# EAGLE schematic 1EE2CE-Multicell Battery Load Analyzer (EAGLE 9.7.0)

## Sheet 1 of 6
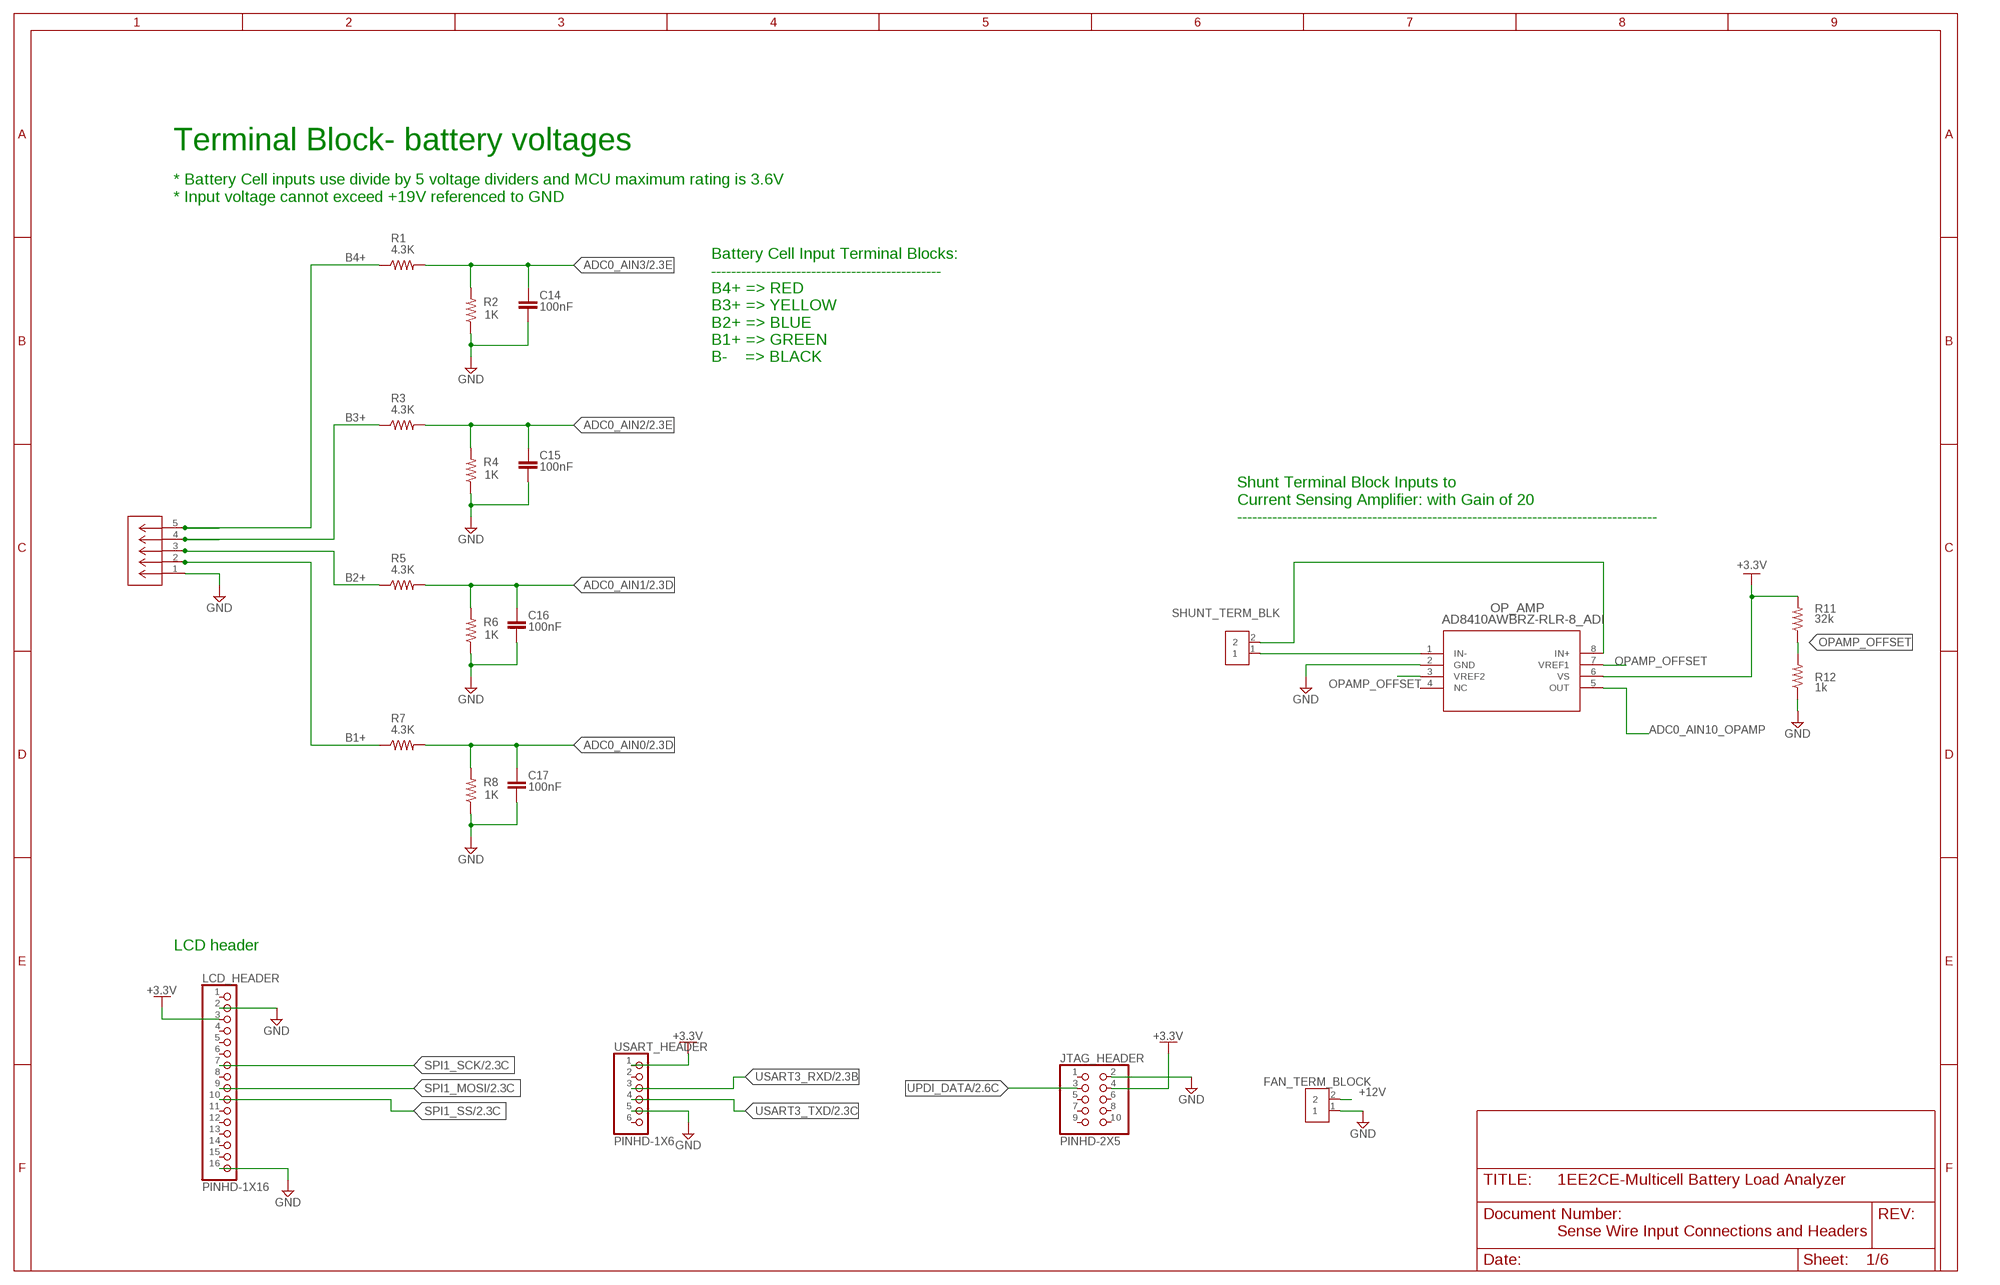
[diagram p0: schematic, sheet 1]

### Parts
BATTERY_TERM_BLK  OSTVN05A150CONN5_516X256_OST  [CONN5_516X256_OST]
C14  100nF  C_CHIP-0805(2012-METRIC)  [CAPC2012X110]
C15  100nF  C_CHIP-0805(2012-METRIC)  [CAPC2012X110]
C16  100nF  C_CHIP-0805(2012-METRIC)  [CAPC2012X110]
C17  100nF  C_CHIP-0805(2012-METRIC)  [CAPC2012X110]
FAN_TERM_BLOCK  TERM-BLK-2P  2828XX-2282837-2  [TERMBLK_508-2N]
JTAG_HEADER  PINHD-2X5  [2X05]
LCD_HEADER  PINHD-1X16  [1X16]
OP_AMP  AD8410AWBRZ-RLR-8_ADI  [R-8_ADI]
R1  4.3K  R-US_R0805  [R0805]
R2  1K  R-US_R0805  [R0805]
R3  4.3K  R-US_R0805  [R0805]
R4  1K  R-US_R0805  [R0805]
R5  4.3K  R-US_R0805  [R0805]
R6  1K  R-US_R0805  [R0805]
R7  4.3K  R-US_R0805  [R0805]
R8  1K  R-US_R0805  [R0805]
R11  32k  R-US_R0805  [R0805]
R12  1k  R-US_R0805  [R0805]
SHUNT_TERM_BLK  TERM-BLK-2P  2828XX-2282837-2  [TERMBLK_508-2N]
USART_HEADER  PINHD-1X6  [1X06]

### Nets
+3.3V: JTAG_HEADER.4 LCD_HEADER.3 OP_AMP.6(VS) R11.2 USART_HEADER.1 ; also sheet 2,3,4,6
+12V: FAN_TERM_BLOCK.2 ; also sheet 3,4,6
ADC0_AIN0: C17.1 R7.2 R8.2 ; also sheet 2,6
ADC0_AIN1: C16.1 R5.2 R6.2 ; also sheet 2,6
ADC0_AIN2: C15.1 R3.2 R4.2 ; also sheet 2,6
ADC0_AIN3: C14.1 R1.2 R2.2 ; also sheet 2,6
ADC0_AIN10_OPAMP: OP_AMP.5(OUT) ; also sheet 2,6
B1+: BATTERY_TERM_BLK.2 R7.1
B2+: BATTERY_TERM_BLK.3 R5.1
B3+: BATTERY_TERM_BLK.4 R3.1
B4+: BATTERY_TERM_BLK.5 R1.1
GND: BATTERY_TERM_BLK.1 C14.2 C15.2 C16.2 C17.2 FAN_TERM_BLOCK.1 JTAG_HEADER.2 LCD_HEADER.2 LCD_HEADER.16 OP_AMP.2(GND) R2.1 R4.1 R6.1 R8.1 R12.1 USART_HEADER.5 ; also sheet 2,3,4,5,6
N$8: OP_AMP.1(IN-) SHUNT_TERM_BLK.1
N$11: OP_AMP.8(IN+) SHUNT_TERM_BLK.2
OPAMP_OFFSET: OP_AMP.3(VREF2) OP_AMP.7(VREF1) R11.1 R12.2
SPI1_MOSI: LCD_HEADER.9 ; also sheet 2,6
SPI1_SCK: LCD_HEADER.7 ; also sheet 2,6
SPI1_SS: LCD_HEADER.10 ; also sheet 2,6
UPDI_DATA: JTAG_HEADER.3 ; also sheet 2
USART3_RXD: USART_HEADER.3 ; also sheet 2,6
USART3_TXD: USART_HEADER.4 ; also sheet 2,6
Unconnected: JTAG_HEADER.1 JTAG_HEADER.5 JTAG_HEADER.6 JTAG_HEADER.7 JTAG_HEADER.8 JTAG_HEADER.9 JTAG_HEADER.10 LCD_HEADER.1 LCD_HEADER.4 LCD_HEADER.5 LCD_HEADER.6 LCD_HEADER.8 LCD_HEADER.11 LCD_HEADER.12 LCD_HEADER.13 LCD_HEADER.14 LCD_HEADER.15 OP_AMP.4(NC) USART_HEADER.2 USART_HEADER.6

### Notes on the sheet
- Terminal Block- battery voltages
- * Battery Cell inputs use divide by 5 voltage dividers and MCU maximum rating is 3.6V
  * Input voltage cannot exceed +19V referenced to GND
- Battery Cell Input Terminal Blocks:
  ----------------------------------------------
  B4+ => RED
  B3+ => YELLOW
  B2+ => BLUE
  B1+ => GREEN
  B-    => BLACK
- Shunt Terminal Block Inputs to 
  Current Sensing Amplifier: with Gain of 20
  ------------------------------------------------------------------------------------
- LCD header
- Sense Wire Input Connections and Headers

## Sheet 2 of 6
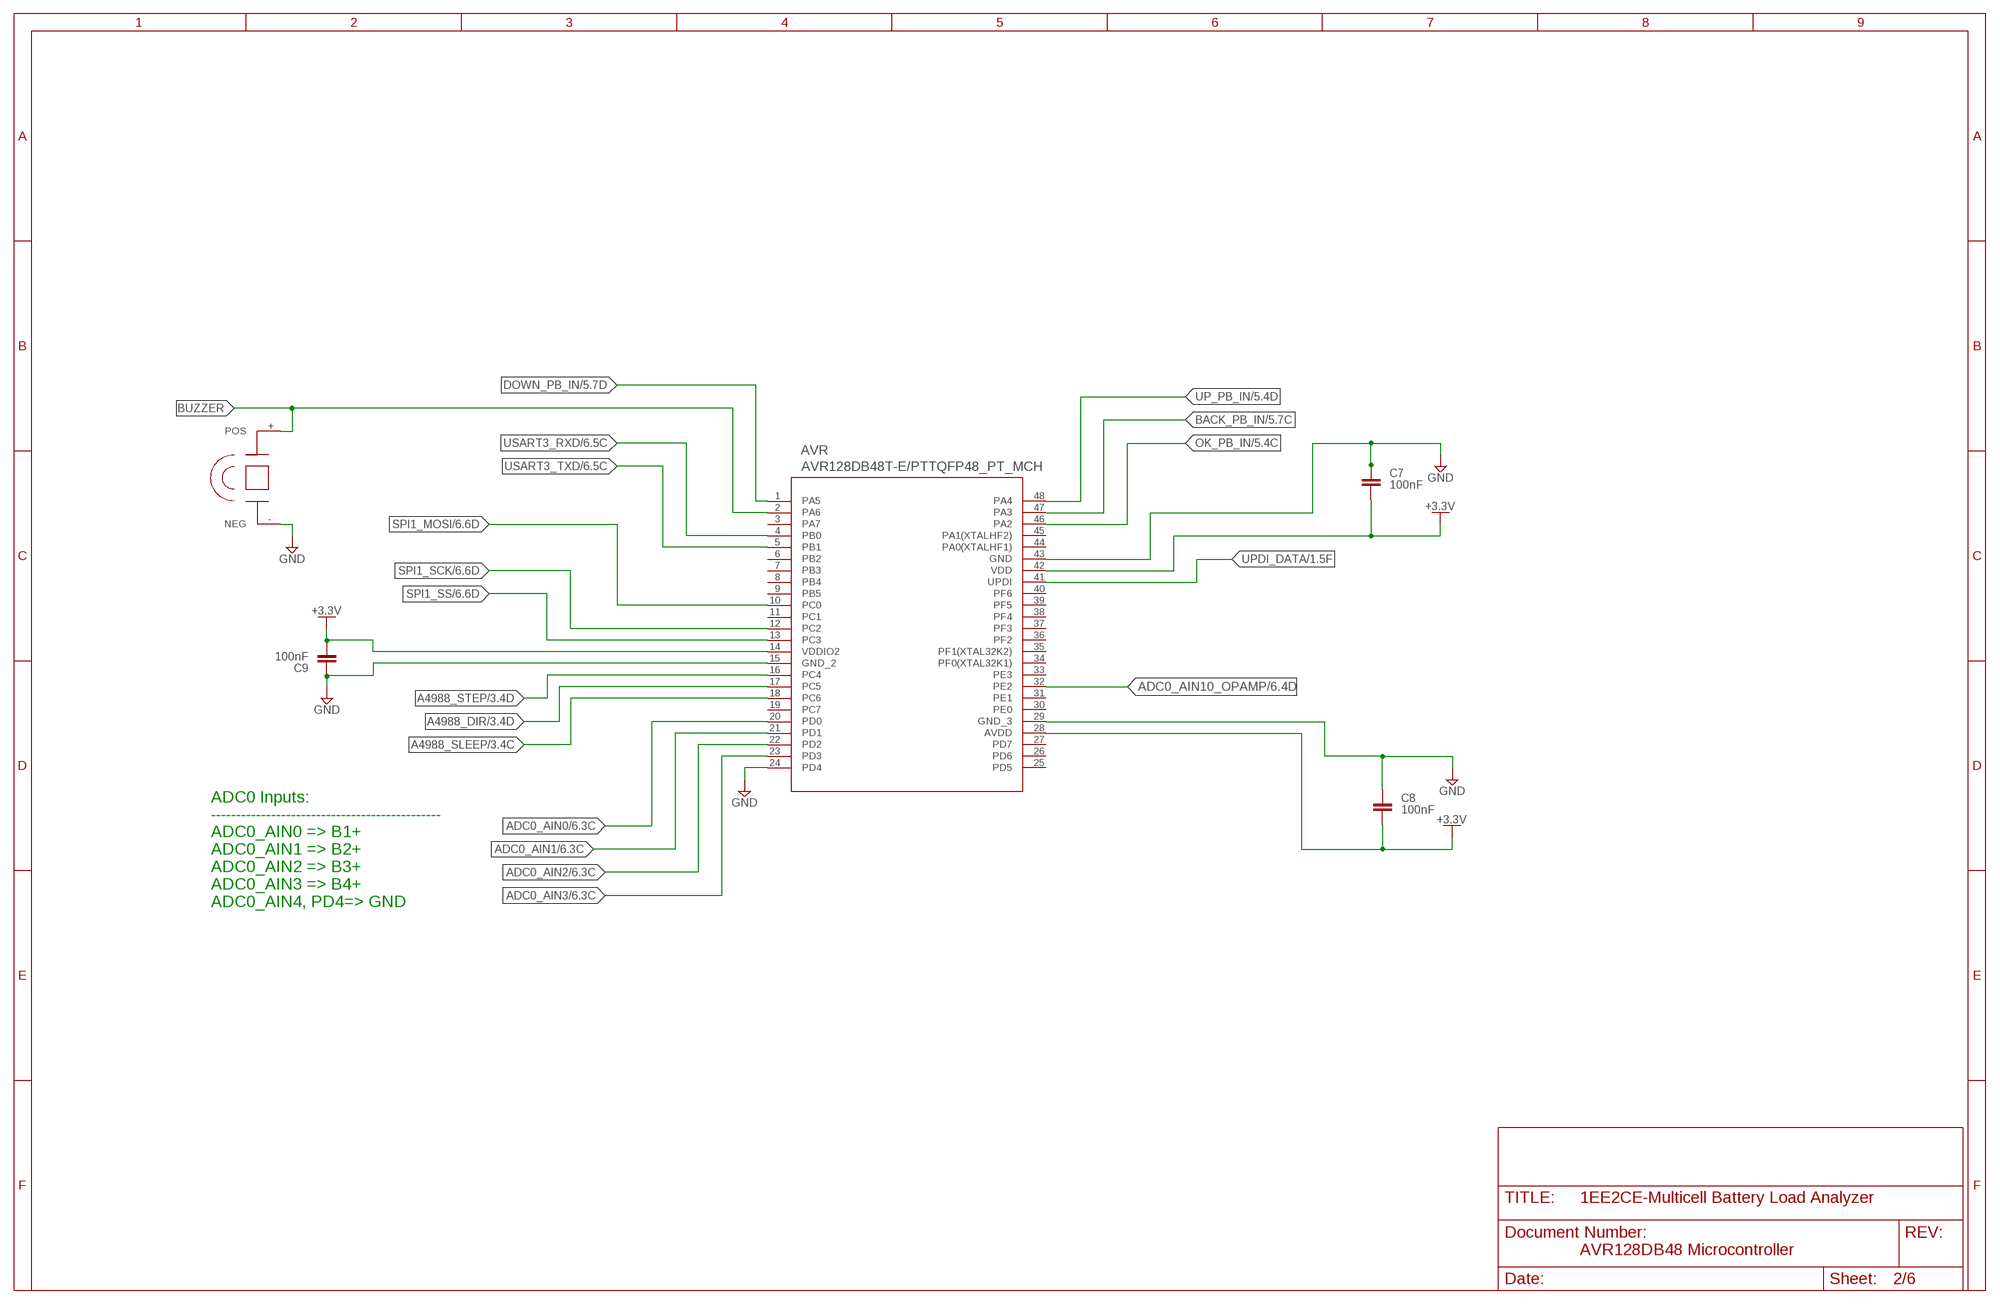
[diagram p1: schematic, sheet 2]

### Parts
AVR  AVR128DB48T-E/PTTQFP48_PT_MCH  [TQFP48_PT_MCH]
C7  100nF  C-EUC0805  [C0805]
C8  100nF  C-EUC0805  [C0805]
C9  100nF  C-EUC0805  [C0805]
U$4  BUZZER_  [BUZZER]

### Nets
+3.3V: AVR.14(VDDIO2) AVR.28(AVDD) AVR.42(VDD) C7.1 C8.1 C9.1 ; also sheet 1,3,4,6
A4988_DIR: AVR.17(PC5) ; also sheet 3,6
A4988_SLEEP: AVR.18(PC6) ; also sheet 3,6
A4988_STEP: AVR.16(PC4) ; also sheet 3,6
ADC0_AIN0: AVR.20(PD0) ; also sheet 1,6
ADC0_AIN1: AVR.21(PD1) ; also sheet 1,6
ADC0_AIN2: AVR.22(PD2) ; also sheet 1,6
ADC0_AIN3: AVR.23(PD3) ; also sheet 1,6
ADC0_AIN10_OPAMP: AVR.32(PE2) ; also sheet 1,6
BACK_PB_IN: AVR.47(PA3) ; also sheet 5
BUZZER: AVR.2(PA6) U$4.+(POS)
DOWN_PB_IN: AVR.1(PA5) ; also sheet 5
GND: AVR.15(GND_2) AVR.24(PD4) AVR.29(GND_3) AVR.43(GND) C7.2 C8.2 C9.2 U$4.-(NEG) ; also sheet 1,3,4,5,6
OK_PB_IN: AVR.46(PA2) ; also sheet 5
SPI1_MOSI: AVR.10(PC0) ; also sheet 1,6
SPI1_SCK: AVR.12(PC2) ; also sheet 1,6
SPI1_SS: AVR.13(PC3) ; also sheet 1,6
UP_PB_IN: AVR.48(PA4) ; also sheet 5
UPDI_DATA: AVR.41(UPDI) ; also sheet 1
USART3_RXD: AVR.4(PB0) ; also sheet 1,6
USART3_TXD: AVR.5(PB1) ; also sheet 1,6
Unconnected: AVR.3(PA7) AVR.6(PB2) AVR.7(PB3) AVR.8(PB4) AVR.9(PB5) AVR.11(PC1) AVR.19(PC7) AVR.25(PD5) AVR.26(PD6) AVR.27(PD7) AVR.30(PE0) AVR.31(PE1) AVR.33(PE3) AVR.34(PF0(XTAL32K1)) AVR.35(PF1(XTAL32K2)) AVR.36(PF2) AVR.37(PF3) AVR.38(PF4) AVR.39(PF5) AVR.40(PF6) AVR.44(PA0(XTALHF1)) AVR.45(PA1(XTALHF2))

### Notes on the sheet
- ADC0 Inputs:
  ----------------------------------------------
  ADC0_AIN0 => B1+
  ADC0_AIN1 => B2+
  ADC0_AIN2 => B3+
  ADC0_AIN3 => B4+
  ADC0_AIN4, PD4=> GND
- AVR128DB48 Microcontroller

## Sheet 3 of 6
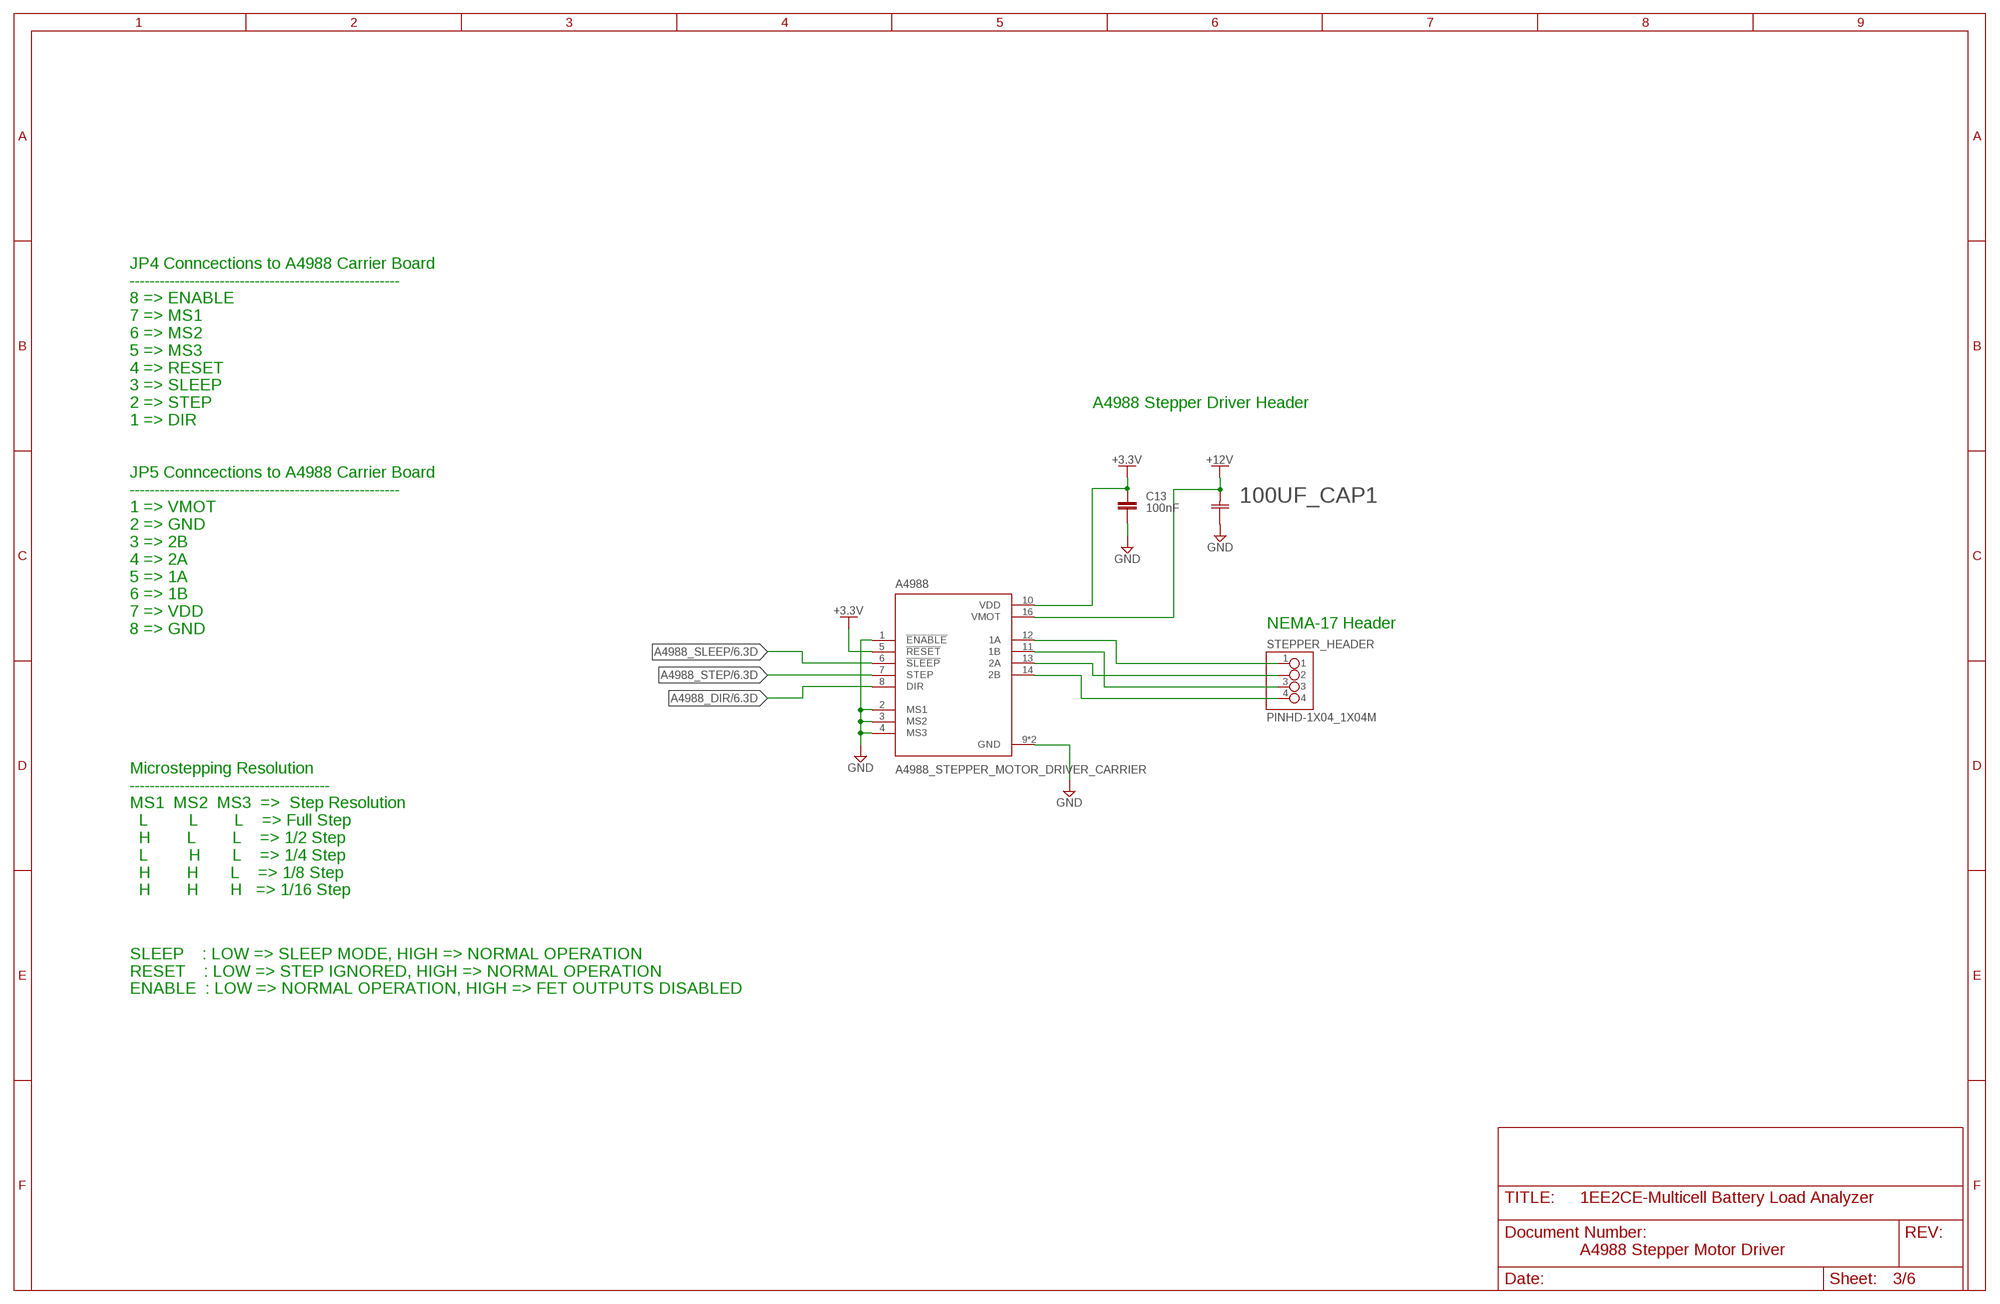
[diagram p2: schematic, sheet 3]

### Parts
100UF_CAP1  GRM31CD80J107MEA8KCAP_GRM31C_MUR  [CAP_GRM31C_MUR]
A4988  A4988_STEPPER_MOTOR_DRIVER_CARRIER  [MODULE_A4988_STEPPER_MOTOR_DRIVER_CARRIER]
C13  100nF  C-EUC0805  [C0805]
STEPPER_HEADER  PINHD-1X04_1X04M  [1X04]

### Nets
+3.3V: A4988.5(!RESET) A4988.10(VDD) C13.2 ; also sheet 1,2,4,6
+12V: 100UF_CAP1.2 A4988.16(VMOT) ; also sheet 1,4,6
A4988_DIR: A4988.8(DIR) ; also sheet 2,6
A4988_SLEEP: A4988.6(!SLEEP) ; also sheet 2,6
A4988_STEP: A4988.7(STEP) ; also sheet 2,6
GND: 100UF_CAP1.1 A4988.1(!ENABLE) A4988.2(MS1) A4988.3(MS2) A4988.4(MS3) A4988.9(GND) A4988.15(GND) C13.1 ; also sheet 1,2,4,5,6
N$2: A4988.13(2A) STEPPER_HEADER.2
N$3: A4988.14(2B) STEPPER_HEADER.4
N$4: A4988.11(1B) STEPPER_HEADER.3
N$5: A4988.12(1A) STEPPER_HEADER.1

### Notes on the sheet
- A4988 Stepper Driver Header
- JP4 Conncections to A4988 Carrier Board
  ------------------------------------------------------
  8 => ENABLE       
  7 => MS1        
  6 => MS2         
  5 => MS3        
  4 => RESET      
  3 => SLEEP         
  2 => STEP          
  1 => DIR
- NEMA-17 Header
- JP5 Conncections to A4988 Carrier Board
  ------------------------------------------------------
  1 => VMOT       
  2 => GND        
  3 => 2B         
  4 => 2A        
  5 => 1A      
  6 => 1B         
  7 => VDD          
  8 => GND
- Microstepping Resolution
  ----------------------------------------
  MS1  MS2  MS3  =>  Step Resolution
    L         L        L    => Full Step
    H        L        L    => 1/2 Step
    L         H       L    => 1/4 Step
    H        H       L    => 1/8 Step
    H        H       H   => 1/16 Step
- SLEEP    : LOW => SLEEP MODE, HIGH => NORMAL OPERATION
  RESET    : LOW => STEP IGNORED, HIGH => NORMAL OPERATION
  ENABLE  : LOW => NORMAL OPERATION, HIGH => FET OUTPUTS DISABLED
- A4988 Stepper Motor Driver

## Sheet 4 of 6
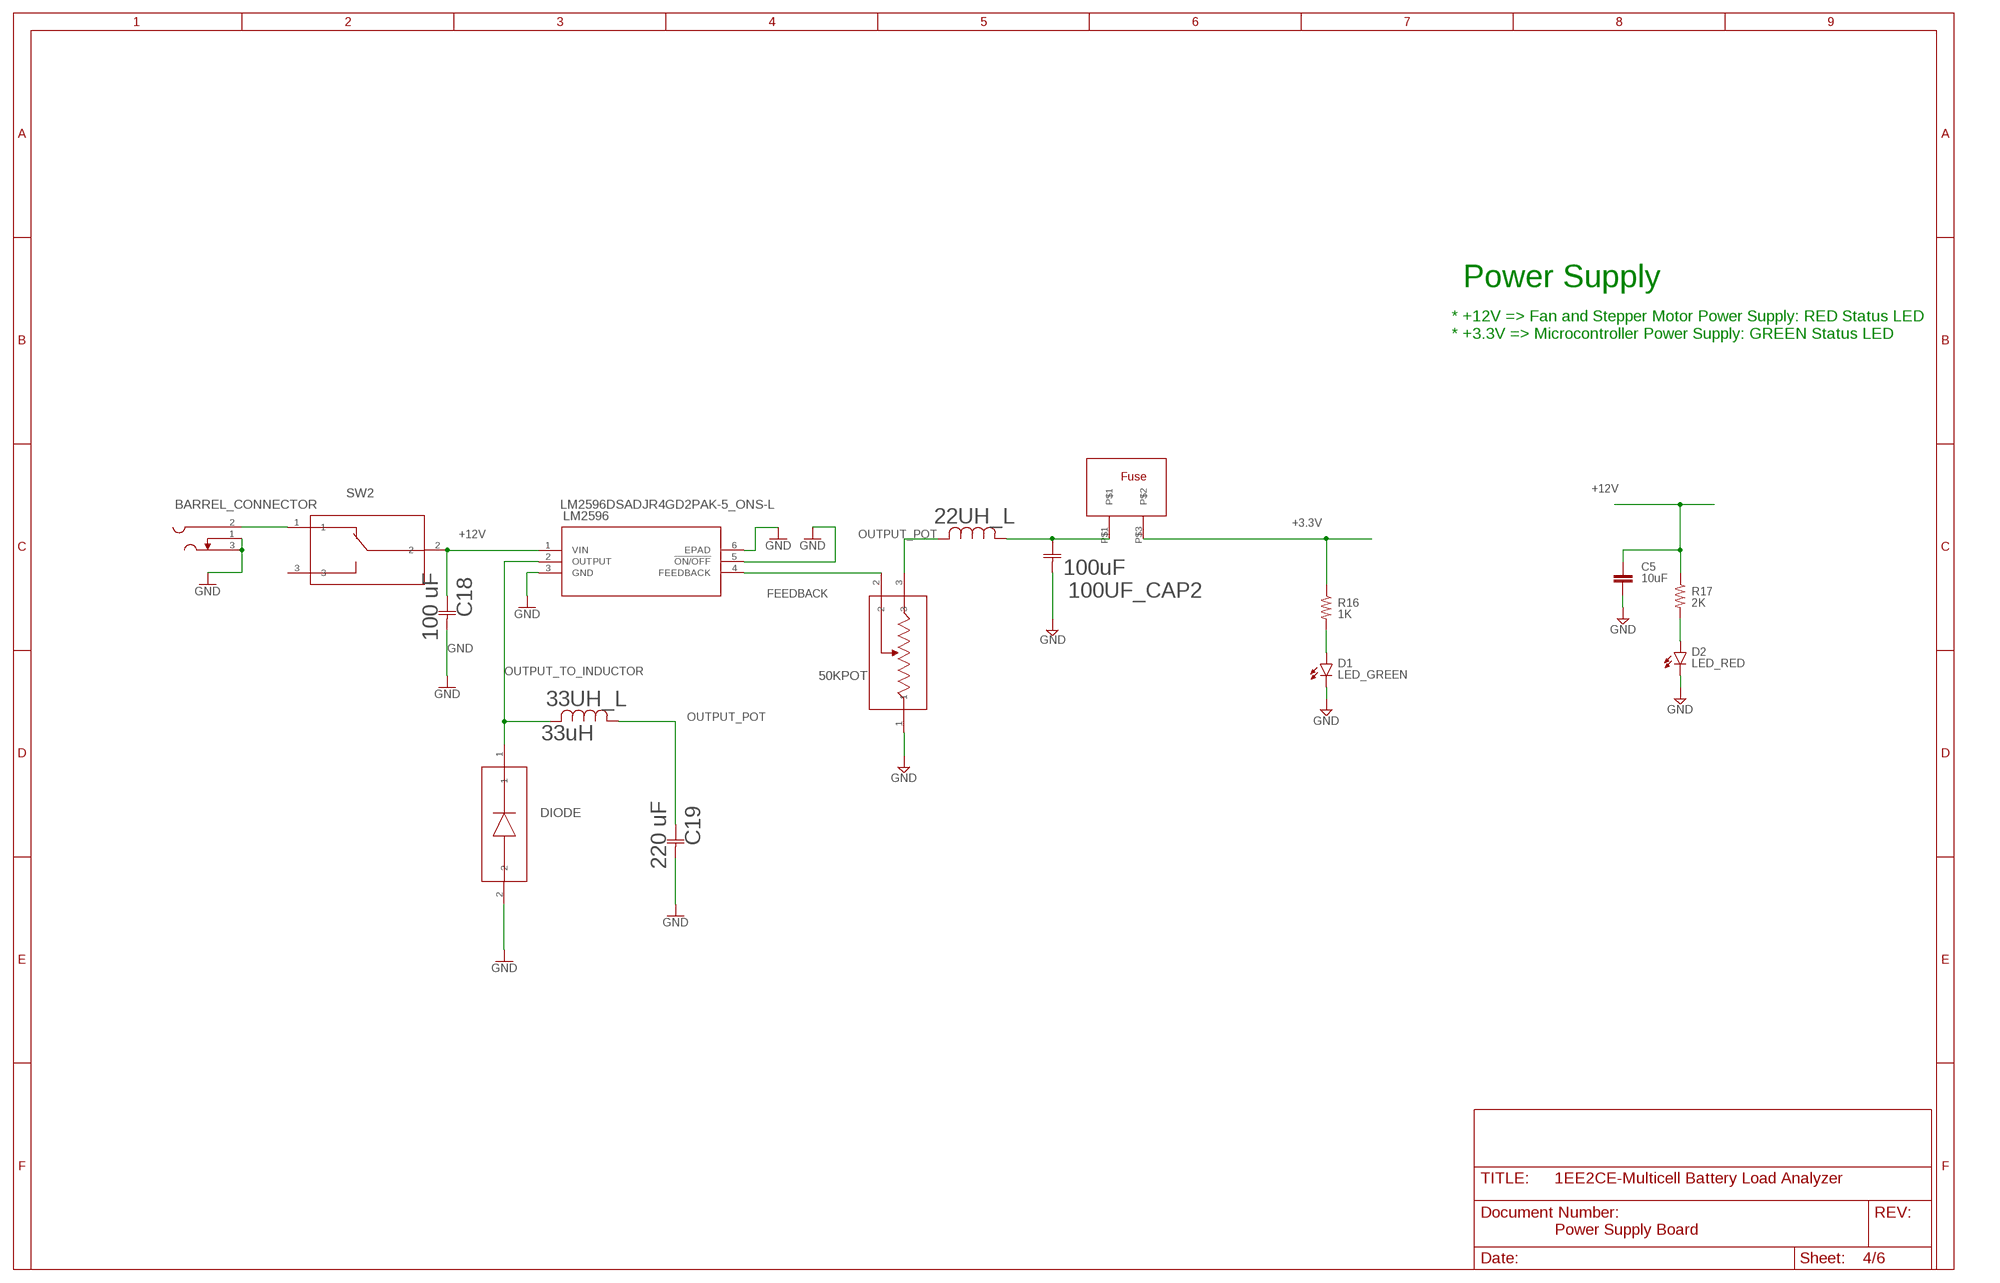
[diagram p3: schematic, sheet 4]

### Parts
22UH_L  CBC3225T220KRIND_TAIYO_CBC3225_TAY  [IND_TAIYO_CBC3225_TAY]
33UH_L  33uH  NR6028T330MIND_TAIYO_NR6028_TAY  [IND_TAIYO_NR6028_TAY]
50KPOT  PV36W503C01B00RES_PV36W503C01B00_BRN  [RES_PV36W503C01B00_BRN]
100UF_CAP2  100uF  GRM31CD80J107MEA8KCAP_GRM31C_MUR  [CAP_GRM31C_MUR]
BARREL_CONNECTOR  RASM712BKZJACK_RASM712BKZ_SWC  [JACK_RASM712BKZ_SWC]
C5  10uF  C-EUC0805  [C0805]
C18  100 uF  35YXJ100M6.3X11CAP_YX_6P3X11_RUB  [CAP_YX_6P3X11_RUB]
C19  220 uF  25YXG220MEFC6.3X11CAP_YX_6P3X11_RUB  [CAP_YX_6P3X11_RUB]
D1  LED_GREEN  CHIP-ROUND-G_1209  [LEDC3224X250N_RND-G]
D2  LED_RED  CHIP-ROUND-R_1209  [LEDC3224X250N_RND-R]
DIODE  SS34FASOD_34FA_ONS  [SOD_34FA_ONS]
LM2596  LM2596DSADJR4GD2PAK-5_ONS-L  [D2PAK-5_ONS-L]
R16  1K  R-US_R0805  [R0805]
R17  2K  R-US_R0805  [R0805]
SW2  500SSP3S1M6QEASW3_500SSP3S1M6QEA_EWI  [SW3_500SSP3S1M6QEA_EWI]
U$1  FUSE_1A  [FUSE]

### Nets
+3.3V: R16.1 U$1.P$3 ; also sheet 1,2,3,6
+12V: C5.1 C18.1 LM2596.1(VIN) R17.1 SW2.2 ; also sheet 1,3,6
FEEDBACK: 50KPOT.2 LM2596.4(FEEDBACK)
GND: 50KPOT.1 100UF_CAP2.2 BARREL_CONNECTOR.1(SLEEVE) BARREL_CONNECTOR.3(SLEEVESHUNT) C5.2 C18.2 C19.2 D1.C D2.C DIODE.2 LM2596.3(GND) LM2596.5(!ON/OFF) LM2596.6(EPAD) ; also sheet 1,2,3,5,6
N$6: D1.A R16.2
N$7: D2.A R17.2
N$9: BARREL_CONNECTOR.2(CENTERPIN) SW2.1
N$10: 22UH_L.1 100UF_CAP2.1 U$1.P$1
OUTPUT_POT: 22UH_L.2 33UH_L.1 50KPOT.3 C19.1
OUTPUT_TO_INDUCTOR: 33UH_L.2 DIODE.1 LM2596.2(OUTPUT)
Unconnected: SW2.3

### Notes on the sheet
- Power Supply
- * +12V => Fan and Stepper Motor Power Supply: RED Status LED
  * +3.3V => Microcontroller Power Supply: GREEN Status LED
- Power Supply Board

## Sheet 5 of 6
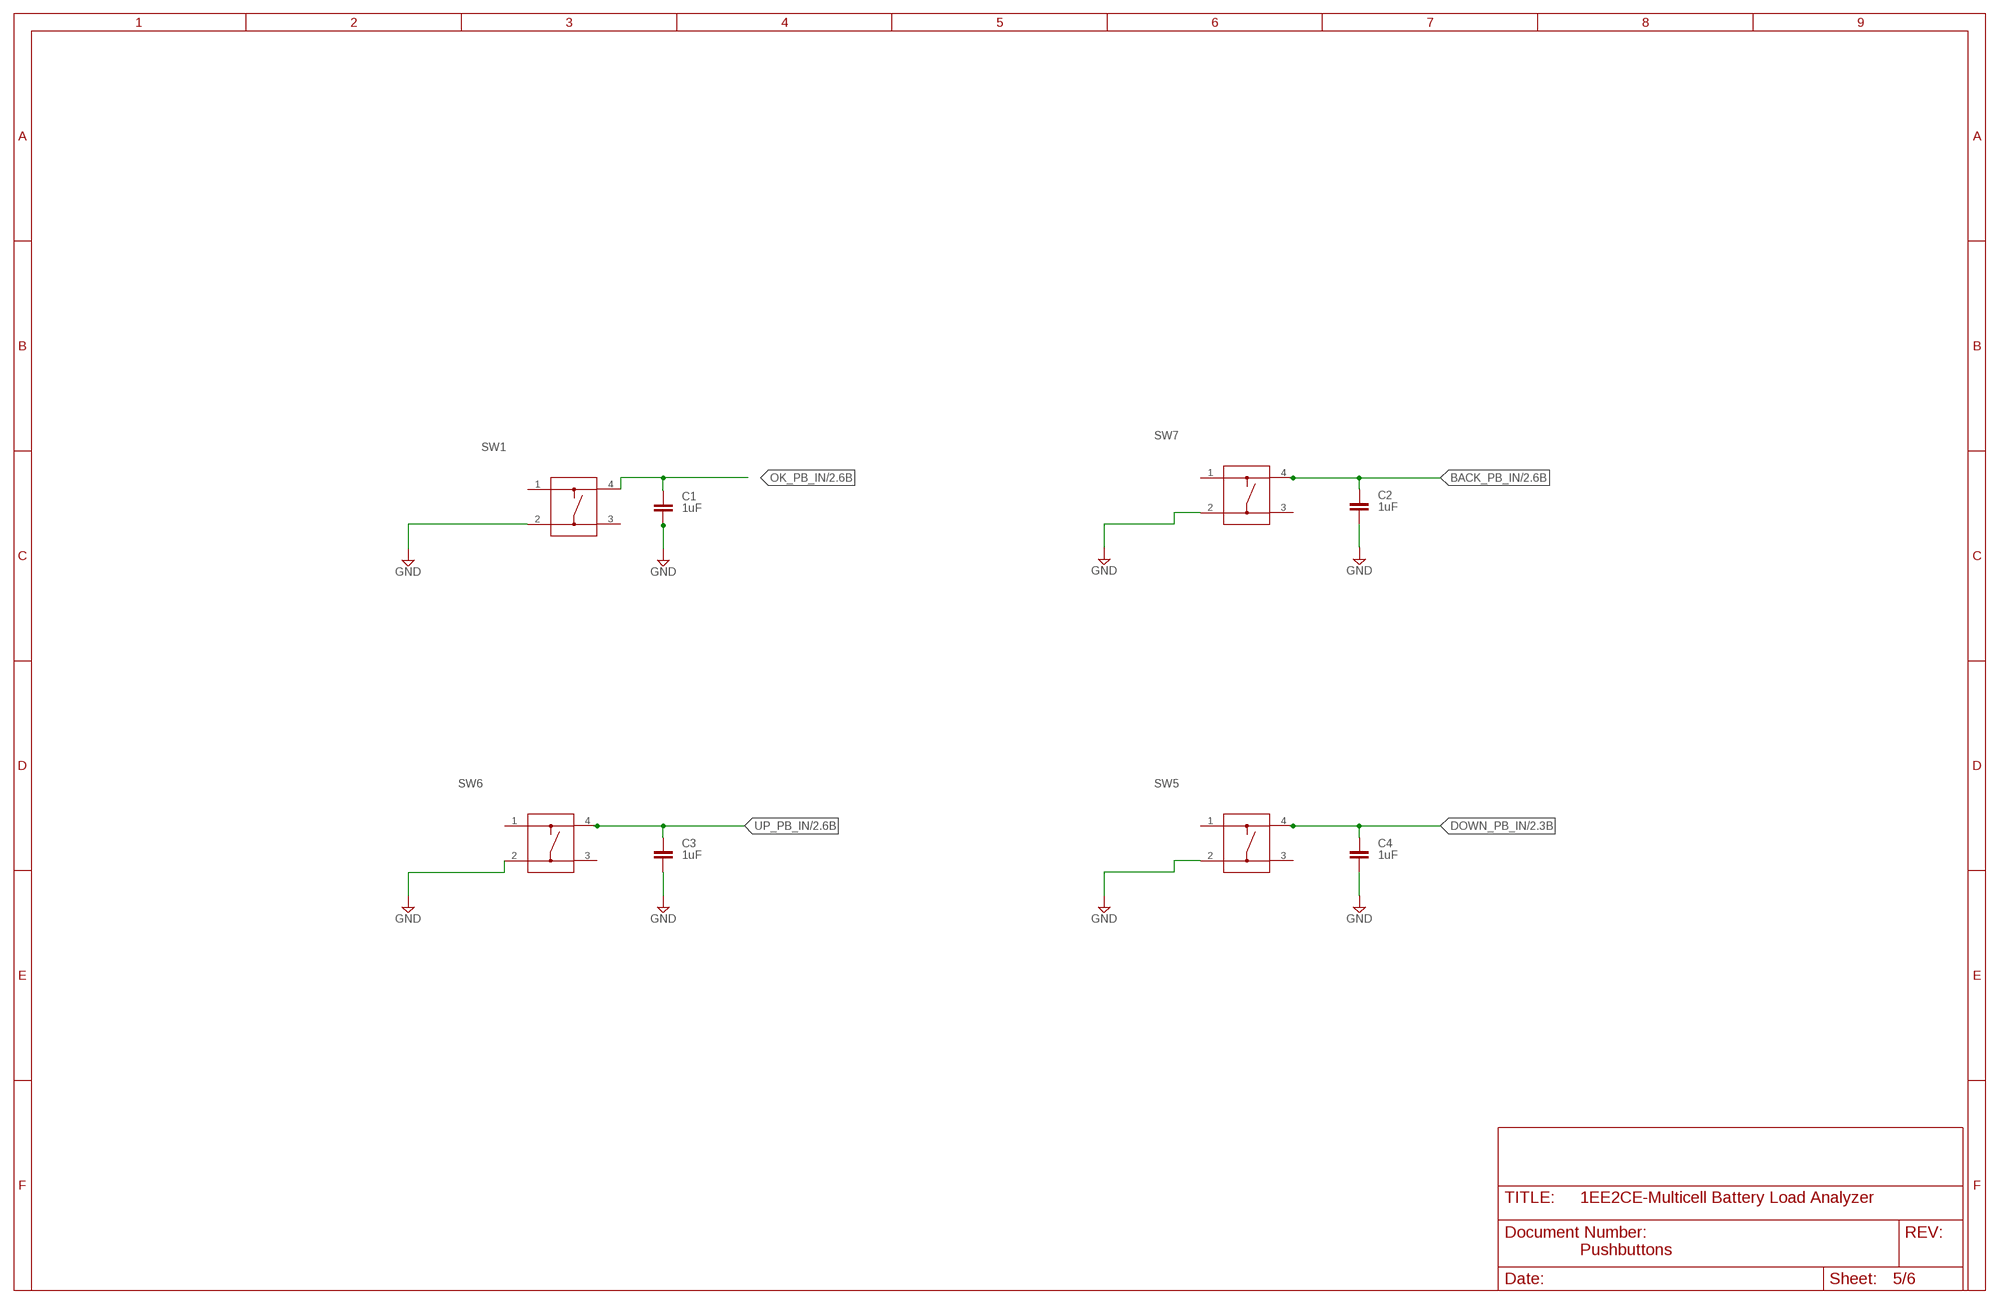
[diagram p4: schematic, sheet 5]

### Parts
C1  1uF  C-EUC0805  [C0805]
C2  1uF  C-EUC0805  [C0805]
C3  1uF  C-EUC0805  [C0805]
C4  1uF  C-EUC0805  [C0805]
SW1  D6R90F2LFSD6R90_CNK  [D6R90_CNK]
SW5  D6R90F2LFSD6R90_CNK  [D6R90_CNK]
SW6  D6R90F2LFSD6R90_CNK  [D6R90_CNK]
SW7  D6R90F2LFSD6R90_CNK  [D6R90_CNK]

### Nets
BACK_PB_IN: C2.1 SW7.4 ; also sheet 2
DOWN_PB_IN: C4.1 SW5.4 ; also sheet 2
GND: C1.2 C2.2 C3.2 C4.2 SW1.2 SW5.2 SW6.2 SW7.2 ; also sheet 1,2,3,4,6
OK_PB_IN: C1.1 SW1.4 ; also sheet 2
UP_PB_IN: C3.1 SW6.4 ; also sheet 2
Unconnected: SW1.1 SW1.3 SW5.1 SW5.3 SW6.1 SW6.3 SW7.1 SW7.3

### Notes on the sheet
- Pushbuttons

## Sheet 6 of 6
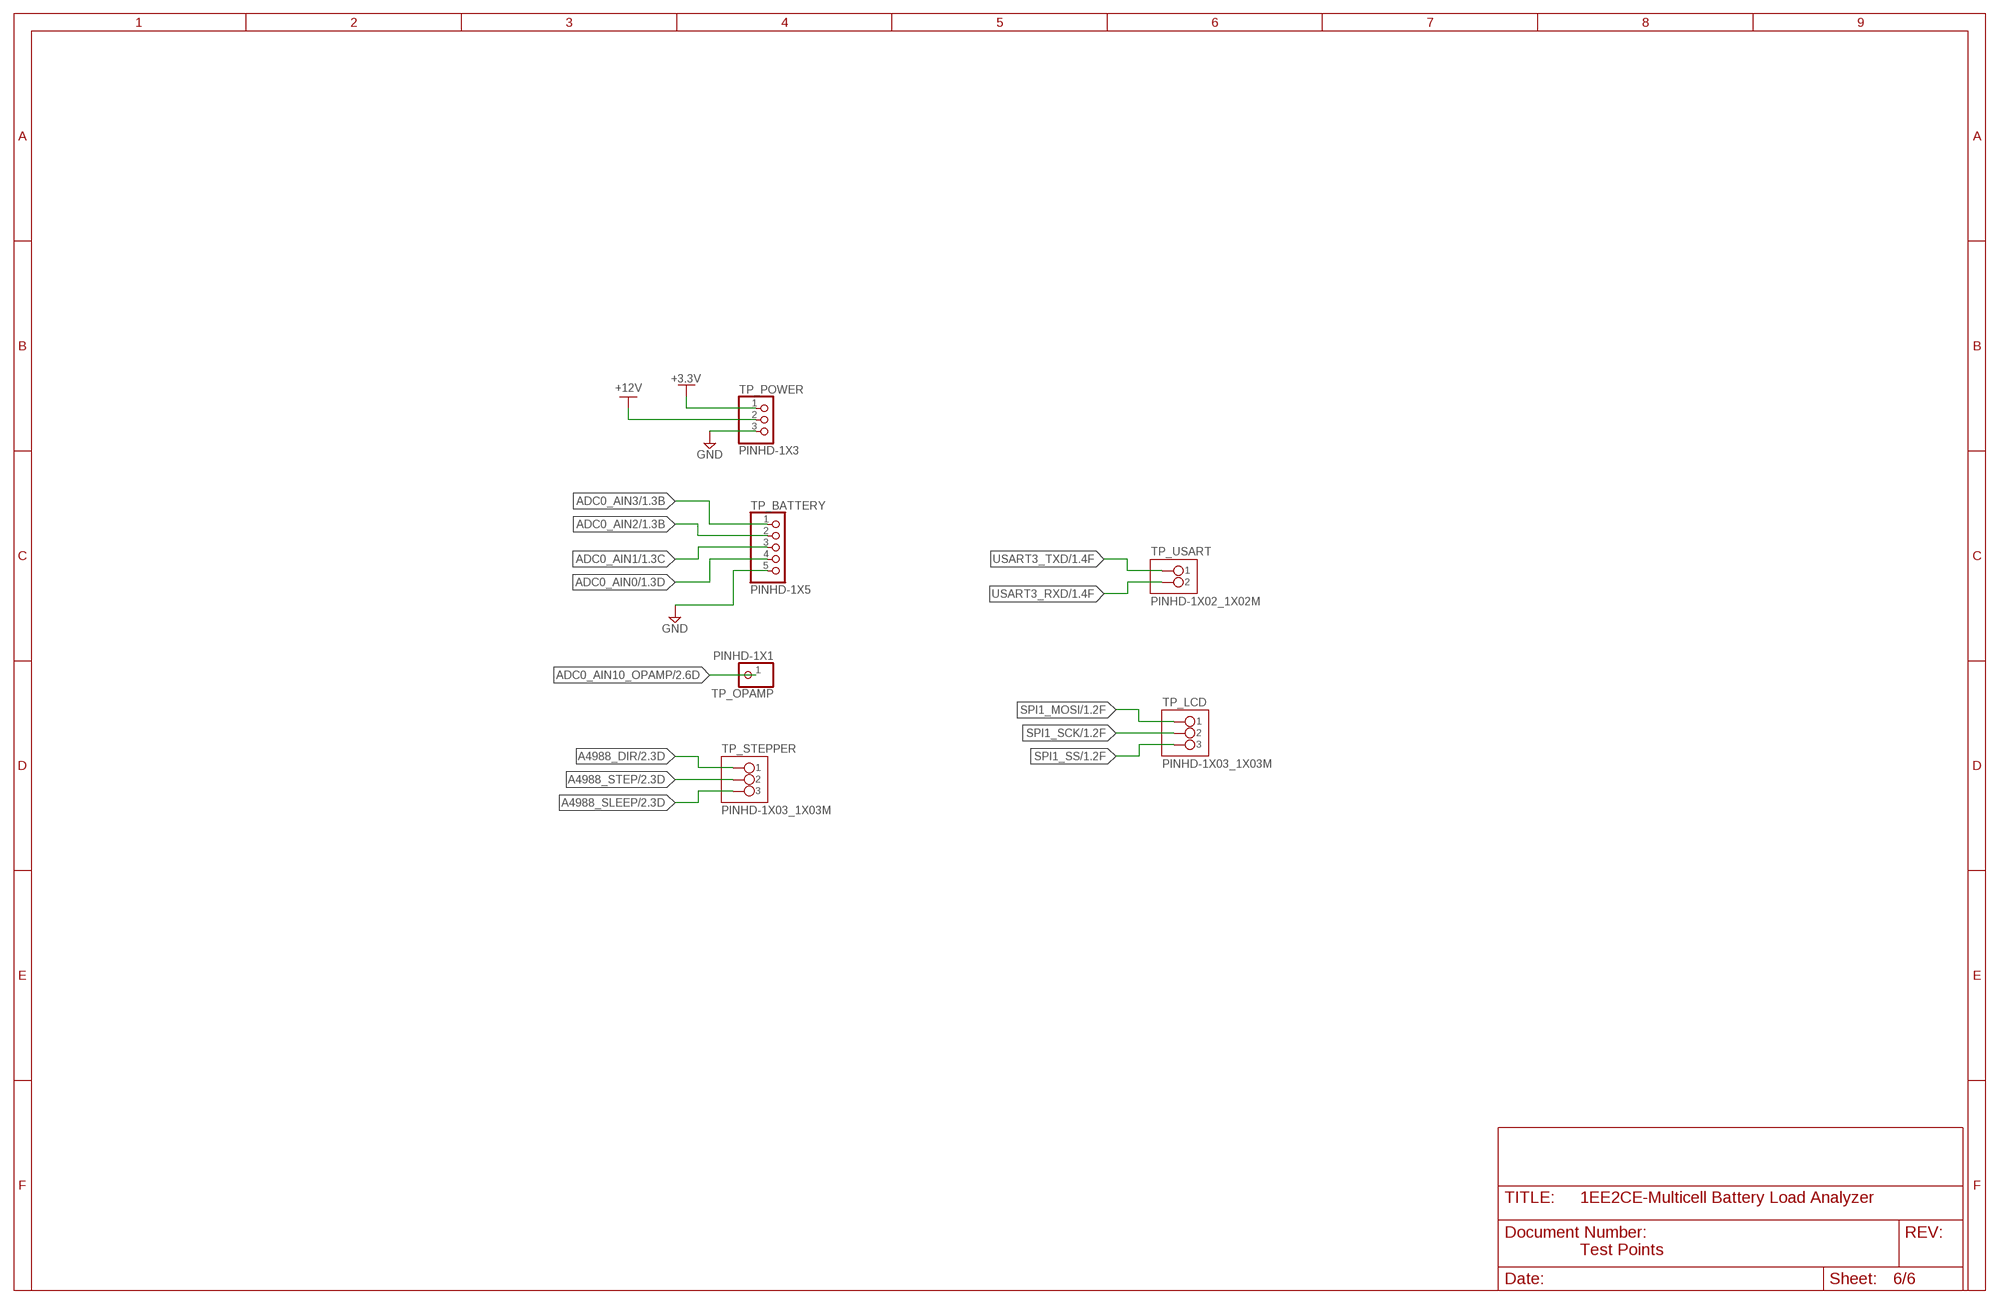
[diagram p5: schematic, sheet 6]

### Parts
TP_BATTERY  PINHD-1X5  [1X05]
TP_LCD  PINHD-1X03_1X03M  [1X03]
TP_OPAMP  PINHD-1X1  [1X01]
TP_POWER  PINHD-1X3  [1X03]
TP_STEPPER  PINHD-1X03_1X03M  [1X03]
TP_USART  PINHD-1X02_1X02M  [1X02]

### Nets
+3.3V: TP_POWER.1 ; also sheet 1,2,3,4
+12V: TP_POWER.2 ; also sheet 1,3,4
A4988_DIR: TP_STEPPER.1 ; also sheet 2,3
A4988_SLEEP: TP_STEPPER.3 ; also sheet 2,3
A4988_STEP: TP_STEPPER.2 ; also sheet 2,3
ADC0_AIN0: TP_BATTERY.4 ; also sheet 1,2
ADC0_AIN1: TP_BATTERY.3 ; also sheet 1,2
ADC0_AIN2: TP_BATTERY.2 ; also sheet 1,2
ADC0_AIN3: TP_BATTERY.1 ; also sheet 1,2
ADC0_AIN10_OPAMP: TP_OPAMP.1 ; also sheet 1,2
GND: TP_BATTERY.5 TP_POWER.3 ; also sheet 1,2,3,4,5
SPI1_MOSI: TP_LCD.1 ; also sheet 1,2
SPI1_SCK: TP_LCD.2 ; also sheet 1,2
SPI1_SS: TP_LCD.3 ; also sheet 1,2
USART3_RXD: TP_USART.2 ; also sheet 1,2
USART3_TXD: TP_USART.1 ; also sheet 1,2

### Notes on the sheet
- Test Points

## Library data of the parts
22UH_L = 2025-04-20_23-54-14_Library:CBC3225T220KR; COPYRIGHT: Copyright (C) 2025 Ultra Librarian. All rights reserved.; MANUFACTURER_PART_NUMBER: CBC3225T220KR; MFR_NAME: Taiyo Yuden
33UH_L = 2025-04-20_23-55-25_Library:NR6028T330M; COPYRIGHT: Copyright (C) 2025 Ultra Librarian. All rights reserved.; MANUFACTURER_PART_NUMBER: NR6028T330M; MFR_NAME: Taiyo Yuden
50KPOT = 2025-04-20_23-31-35_Library:PV36W503C01B00; COPYRIGHT: Copyright (C) 2025 Ultra Librarian. All rights reserved.; MANUFACTURER_PART_NUMBER: PV36W503C01B00; MFR_NAME: Bourns Electronics
100UF_CAP1 100UF_CAP2 = 2025-04-20_23-59-12_Library:GRM31CD80J107MEA8K; COPYRIGHT: Copyright (C) 2025 Ultra Librarian. All rights reserved.; MANUFACTURER_PART_NUMBER: GRM31CD80J107MEA8K; MFR_NAME: Murata
A4988 = A4988_STEPPER_MOTOR_DRIVER_CARRIER:A4988_STEPPER_MOTOR_DRIVER_CARRIER: Check availability <https://pricing.snapeda.com/parts/A4988%20STEPPER%20MOTOR%20DRIVER%20CARRIER/Pololu/view-part?ref=eda>; AVAILABILITY: Not in stock; CHECK_PRICES: https://www.snapeda.com/parts/A4988%20STEPPER%20MOTOR%20DRIVER%20CARRIER/Pololu/view-part/?ref=eda; DESCRIPTION: Stepper Motor Driver; MF: Pololu; MP: A4988 STEPPER MOTOR DRIVER CARRIER; PACKAGE: None; PRICE: None; SNAPEDA_LINK: https://www.snapeda.com/parts/A4988%20STEPPER%20MOTOR%20DRIVER%20CARRIER/Pololu/view-part/?ref=snap
AVR = Multicell Battery Load Analyzer Components:AVR128DB48T-E/PT; COPYRIGHT: Copyright (C) 2024 Ultra Librarian. All rights reserved.; MANUFACTURER_PART_NUMBER: AVR128DB48T-E/PT; MFR_NAME: Microchip
BARREL_CONNECTOR = barrel:RASM712BKZ; COPYRIGHT: Copyright (C) 2024 Ultra Librarian. All rights reserved.; MANUFACTURER_PART_NUMBER: RASM712BKZ; MFR_NAME: Switchcraft; TYPE: Power Connectors
BATTERY_TERM_BLK = 2025-04-23_05-03-51_Library:OSTVN05A150; COPYRIGHT: Copyright (C) 2025 Ultra Librarian. All rights reserved.; MANUFACTURER_PART_NUMBER: OSTVN05A150; MFR_NAME: On Shore Technology
C1-C5 C7-C9 C13 = rcl:C-EU: CAPACITOR, European symbol; SPICEPREFIX: C
C14-C17 = Capacitor:C: Capacitor - Generic; CATEGORY: Capacitor
C18 = 2024-12-20_15-01-37_Library:35YXJ100M6.3X11; COPYRIGHT: Copyright (C) 2024 Ultra Librarian. All rights reserved.; MANUFACTURER_PART_NUMBER: 35YXJ100M6.3X11; MFR_NAME: Rubycon
C19 = 220cap:25YXG220MEFC6.3X11; COPYRIGHT: Copyright (C) 2024 Ultra Librarian. All rights reserved.; MANUFACTURER_PART_NUMBER: 25YXG220MEFC6.3X11; MFR_NAME: Rubycon
D1 = LED:CHIP-ROUND-G; CATEGORY: LED; COLOR: GREEN; DESCRIPTION: CHIP LED ROUND; SUB-CATEGORY: CHIP; TYPE: ROUND_TOP
D2 = LED:CHIP-ROUND-R: LED - Generic; CATEGORY: LED; COLOR: RED; DESCRIPTION: CHIP LED ROUND; SUB-CATEGORY: CHIP; TYPE: ROUND_TOP
DIODE = new_diode:SS34FA; COPYRIGHT: Copyright (C) 2024 Ultra Librarian. All rights reserved.; MANUFACTURER_PART_NUMBER: SS34FA; MFR_NAME: onsemi
FAN_TERM_BLOCK SHUNT_TERM_BLK = Connector:2828XX-2: 2 Position Wire to Board Terminal Block Horizontal with Board Datasheet <https://www.te.com.cn/commerce/DocumentDelivery/DDEController?Action=showdoc&DocId=Catalog+Section%7F1308389_EUROSTYLE_TERMINAL_BLOCKS%7F0607%7Fpdf%7FEnglish%7FENG_CS_1308389_EUROSTYLE_TERMINAL_BLOCKS_0607.pdf%7F2-282837-5>; CATEGORY: Fixed Terminal Blocks; DESCRIPTION: Fixed Terminal Blocks 5.08MM PCB MOUNT 2P; MANUFACTURER: TE Connectivity AMP Connectors; MPN: 282837-2; OPERATING_TEMPERATURE: -40°C to +105°C; PART_STATUS: ACTIVE; PITCH: 0.200" (5.08mm); ROHS_COMPLIANCE: RoHS Compliant; SERIES: Buchanan; SUBCATEGORY: Terminal Blocks; TYPE: Through Hole; Screw - Rising Cage Clamp; Side wire entry, Horizontal with Board
JTAG_HEADER = Connector:PINHD-2X5: PIN HEADER; CATEGORY: Headers; DESCRIPTION: Header, Straight, 2x5 Position; MANUFACTURER: Generic; MPN: Generic; OPERATING_TEMPERATURE: Generic; PART_STATUS: Active; PITCH: 0.100" (2.54mm); ROHS_COMPLIANCE: Generic; SERIES: Generic; SUB-CATEGORY: Headers, Male Pins; TYPE: Board to Board or Cable, Unshrouded, Through Hole, Straight
LCD_HEADER = Connector:PINHD-1X16: PIN HEADER; CATEGORY: Headers; DESCRIPTION: Header, Straight, 16 Position; MANUFACTURER: Generic; MPN: Generic; OPERATING_TEMPERATURE: Generic; PART_STATUS: Active; PITCH: 0.100" (2.54mm); ROHS_COMPLIANCE: Generic; SERIES: Generic; SUB-CATEGORY: Headers, Male Pins; TYPE: Board to Board or Cable, Unshrouded, Through Hole, Straight
LM2596 = 2024-12-18_22-44-57_Library:LM2596DSADJR4G; COPYRIGHT: Copyright (C) 2024 Ultra Librarian. All rights reserved.; MANUFACTURER_PART_NUMBER: LM2596DSADJR4G; MFR_NAME: onsemi
OP_AMP = 2025-04-21_02-25-22_Library:AD8410AWBRZ-RL; COPYRIGHT: Copyright (C) 2025 Ultra Librarian. All rights reserved.; MANUFACTURER_PART_NUMBER: AD8410AWBRZ-RL; MFR_NAME: Analog Devices Inc; TYPE: Linear
R1-R8 R11 R12 R16 R17 = rcl:R-US_: RESISTOR, American symbol; SPICEPREFIX: R
STEPPER_HEADER = Tinkercad:PINHD-1X04
SW1 SW5-SW7 = pushbutton:D6R90F2LFS; COPYRIGHT: Copyright (C) 2025 Ultra Librarian. All rights reserved.; MANUFACTURER_PART_NUMBER: D6R90F2LFS; MFR_NAME: C&K Components; TYPE: Pushbutton Switches
SW2 = 2025-04-21_00-24-51_Library:500SSP3S1M6QEA; COPYRIGHT: Copyright (C) 2025 Ultra Librarian. All rights reserved.; MANUFACTURER_PART_NUMBER: 500SSP3S1M6QEA; MFR_NAME: E-Switch
TP_BATTERY = Connector:PINHD-1X5: PIN HEADER; CATEGORY: Headers; DESCRIPTION: Header, Straight, 5 Position; MANUFACTURER: Generic; MPN: Generic; OPERATING_TEMPERATURE: Generic; PART_STATUS: Active; PITCH: 0.100" (2.54mm); ROHS_COMPLIANCE: Generic; SERIES: Generic; SUB-CATEGORY: Headers, Male Pins; TYPE: Board to Board or Cable, Unshrouded, Through Hole, Straight
TP_LCD TP_STEPPER = Tinkercad:PINHD-1X03
TP_OPAMP = Connector:PINHD-1X1: PIN HEADER; CATEGORY: Headers; DESCRIPTION: Header, Straight, 1 Position; MANUFACTURER: Generic; MPN: Generic; OPERATING_TEMPERATURE: Generic; PART_STATUS: Active; PITCH: 0.100" (2.54mm); ROHS_COMPLIANCE: Generic; SERIES: Generic; SUB-CATEGORY: Headers, Male Pins; TYPE: Board to Board or Cable, Unshrouded, Through Hole, Straight
TP_POWER = Connector:PINHD-1X3: PIN HEADER; CATEGORY: Headers; DESCRIPTION: Header, Straight, 3 Position; MANUFACTURER: Generic; MPN: Generic; OPERATING_TEMPERATURE: Generic; PART_STATUS: Active; PITCH: 0.100" (2.54mm); ROHS_COMPLIANCE: Generic; SERIES: Generic; SUB-CATEGORY: Headers, Male Pins; TYPE: Board to Board or Cable, Unshrouded, Through Hole, Straight
TP_USART = Tinkercad:PINHD-1X02
U$1 = Fuse_1A:FUSE_1A
U$4 = buzzer:BUZZER_
USART_HEADER = Connector:PINHD-1X6: PIN HEADER; CATEGORY: Headers; DESCRIPTION: Header, Straight, 6 Position; MANUFACTURER: Generic; MPN: Generic; OPERATING_TEMPERATURE: Generic; PART_STATUS: Active; PITCH: 0.100" (2.54mm); ROHS_COMPLIANCE: Generic; SERIES: Generic; SUB-CATEGORY: Headers, Male Pins; TYPE: Board to Board or Cable, Unshrouded, Through Hole, Straight

## Net classes
1 highest_current: width 1 mm